# EasyEDA Pro project Imported QV-601-Contril.PrjPcb.epro

# Board QV-601-Contril
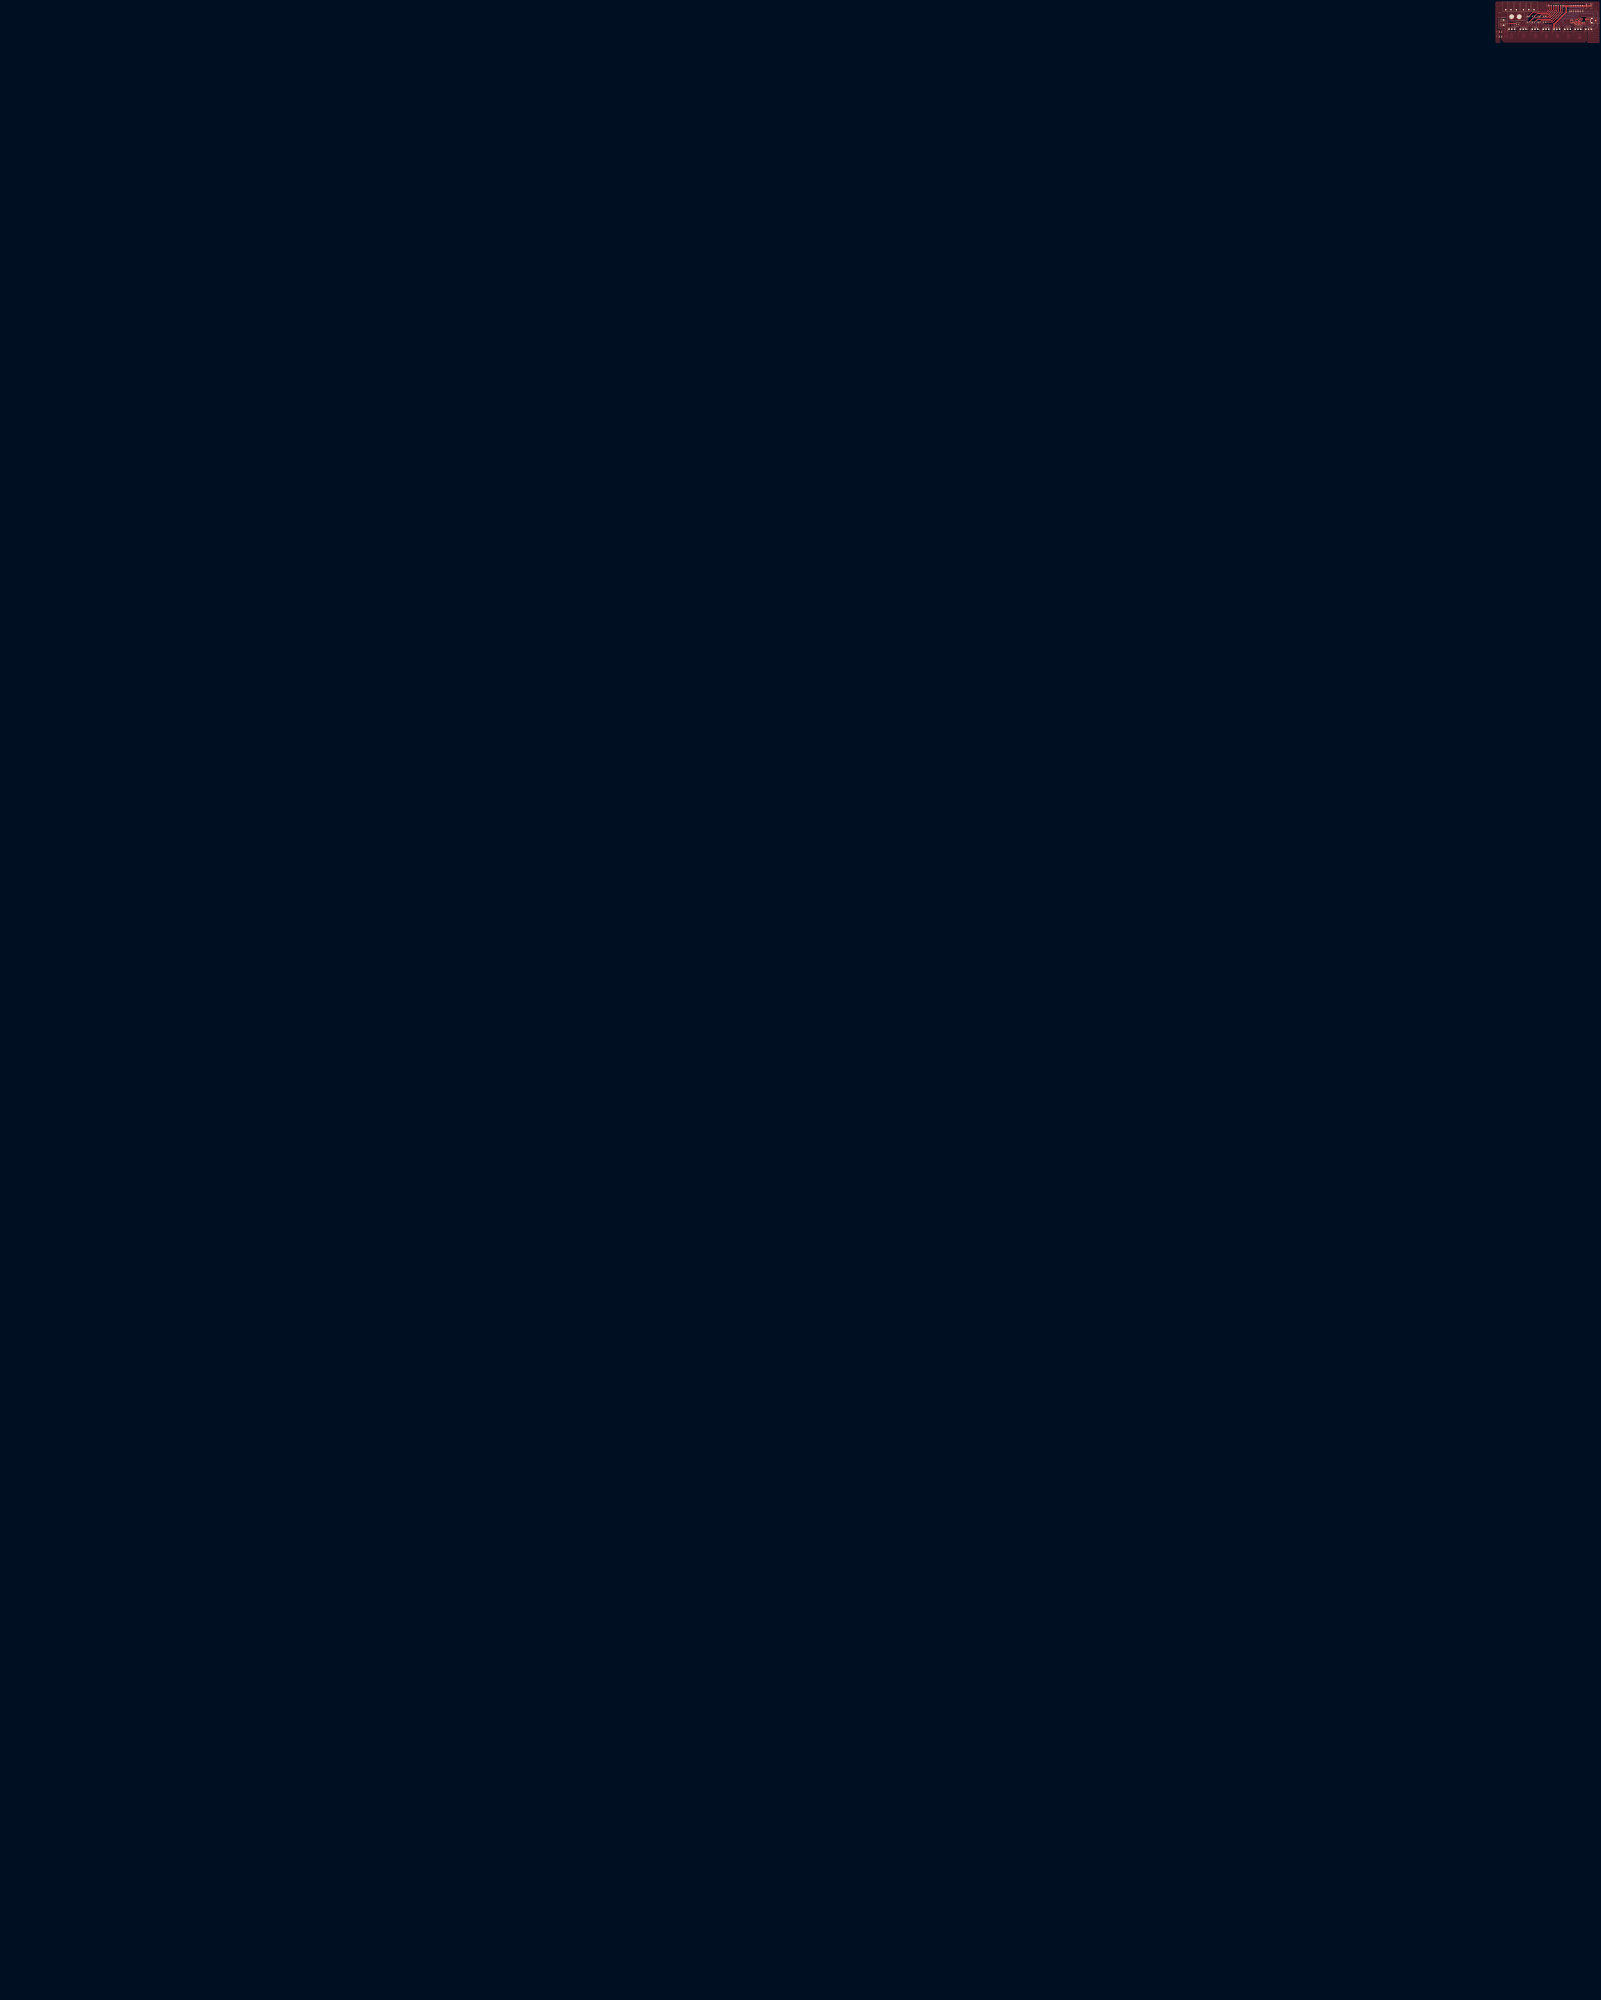
[diagram p0: board, top side]
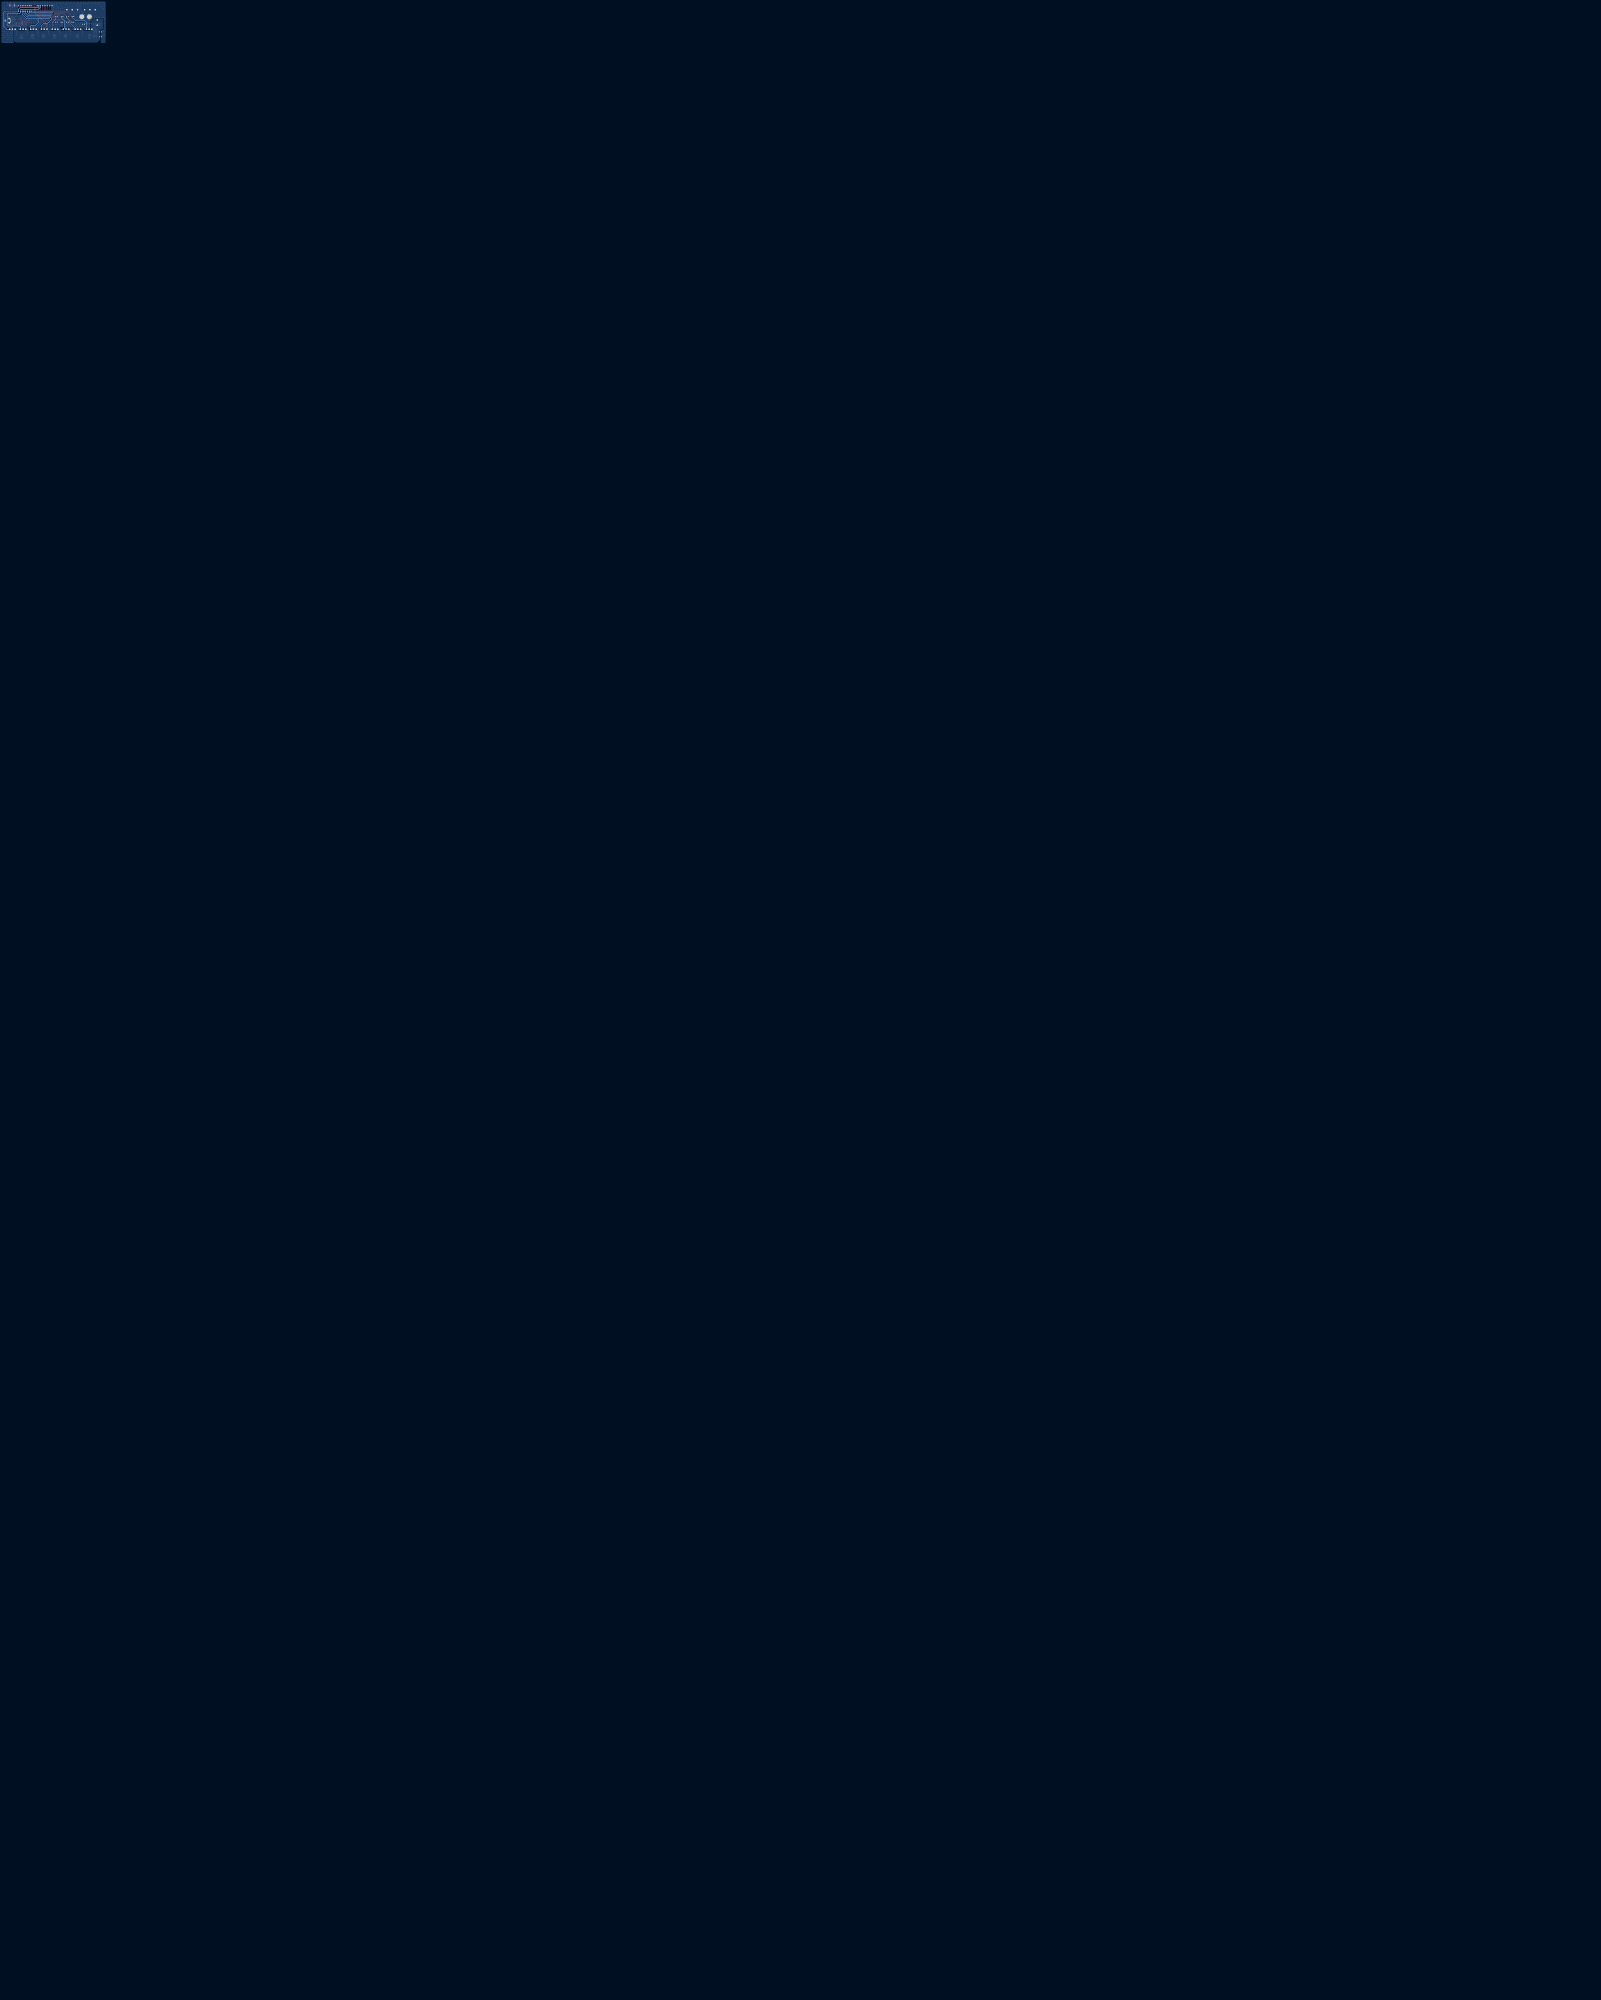
[diagram p1: board, bottom side, seen from below]

Outline 2297.48 x 2870.69 mm; copper layers: Top Layer, Bottom Layer. Coordinates in mm from the lower left corner of the outline.
Outline path: circle c2151.48,2866.69 r1.65 ; circle c2151.48,2814.69 r1.65 ; circle c2293.48,2866.69 r1.65 ; circle c2293.48,2814.69 r1.65 ; 2,663.2 2295.48,2810.69 ; 2,663.2 arc(1792.5,1021.52) 2147.48,2812.69 ; 2,663.2 2295.48,2810.69 ; 2295.48,2810.69 arc(2290.68,0) 150,665.2 2297.48,2868.69 ; 2297.48,2868.69 arc(2296.9,2870.1) 2295.48,2870.69 2149.48,2870.69 arc(2148.07,2870.1) 2147.48,2868.69 2147.48,2812.69 ; 2297.48,2868.69 2297.48,2812.69 ; 2147.48,2812.69 0,721.2

## Placement (name value [footprint] x y rotation side)
C52  CAP NP_C0603_100NF  [C0603]  2263.05 2842.96 90 top
C53  CAP NP_C0603_10UF/10V  [C0603]  2281.6 2845.88 90 top
C54  CAP NP_C0603_10UF/10V  [C0603]  2279.79 2845.88 90 top
C56  CAP NP_C1210_10UF/50V  [C1210]  2257.19 2841.73 90 top
C57  CAP NP_C0603_100NF  [C0603]  2259.75 2841.44 90 top
C58  CAP NP_C0603_100NF  [C0603]  2274.53 2839 180 top
C59  CAP NP_C0603_100NF  [C0603]  2274.53 2840.6 180 top
D1  SS54_SMA_SS34  [SMA]  2267.17 2844.61 180 top
J1  CON2_XT90PBM_XT90PB-M  [XT90PBM]  2170.99 2848.72 0 top
J2  CON2_DBT50G-7R62-2P1_DBT50G-7.6  [DBT50G-7R62-2P1]  2159.7 2844 270 top
J3  CON2_XH2R54-21_ZX-XH2.54-2PZZ  [XH2R54-21]  2156.27 2819.75 180 top
J4  CON2_XH2R54-21_ZX-XH2.54-2PZZ  [XH2R54-21]  2278.88 2864.27 90 top
J5  CON2_XH2R54-21_ZX-XH2.54-2PZZ  [XH2R54-21]  2285.18 2864.25 90 top
J6  CON2_XH2R54-21_ZX-XH2.54-2PZZ  [XH2R54-21]  2193.37 2849.26 0 top
J7  CON2_XH2R54-21_ZX-XH2.54-2PZZ  [XH2R54-21]  2201.22 2849.26 0 top
J8  CON2_XH2R54-21_ZX-XH2.54-2PZZ  [XH2R54-21]  2209.02 2849.26 0 top
J9  CON2_XH2R54-21_ZX-XH2.54-2PZZ  [XH2R54-21]  2216.64 2849.26 0 top
J10  CON2_XH2R54-21_ZX-XH2.54-2PZZ  [XH2R54-21]  2193.55 2840.85 0 top
J11  CON2_XH2R54-21_ZX-XH2.54-2PZZ  [XH2R54-21]  2180.86 2837.91 180 top
J12  CON2_XH2R54-21_ZX-XH2.54-2PZZ  [XH2R54-21]  2201.4 2840.85 0 top
J13  CON2_XH2R54-21_ZX-XH2.54-2PZZ  [XH2R54-21]  2209.2 2840.85 0 top
J14  CON2_XH2R54-21_ZX-XH2.54-2PZZ  [XH2R54-21]  2216.82 2840.85 0 top
J15  CON2_XH2R54-21_ZX-XH2.54-2PZZ  [XH2R54-21]  2156.27 2826.71 180 top
L4  JLSHC0630_3R3M_L0650_CYA0650-22  [L0650]  2272.15 2845.27 90 top
R35  R2_R0603_42.2K  [R0603]  2272.07 2837.07 0 top
R36  R2_R0603_8K  [R0603]  2268.97 2837.07 0 top
R37  R2_R0603_51K  [R0603]  2261.35 2839.91 90 top
R38  R2_R0603_10K  [R0603]  2272.2 2839.84 270 top
R39  R2_R0603_8K  [R0603]  2262.98 2838.39 90 top
R40  R2_R0603_160K  [R0603]  2265.62 2837.07 180 top
U1  CON3_DBT50G-7R62-3P1_DBT50G-7.6  [DBT50G-7R62-3P1]  2170.19 2859.81 180 top
U2  CON10_XH2R54-10P1_ZX-XH2.54-10P  [XH2R54-10P1]  2246.05 2864.35 180 top
U3  CON3_DBT50G-7R62-3P1_DBT50G-7.6  [DBT50G-7R62-3P1]  2195.64 2859.81 180 top
U4  DIP_8P_TA-08R1_TA-08R  [TA-08R1]  2272.68 2856.7 180 top
U5  CON3_VH3R96-3P1_VH3.96-3P ZZ  [VH3R96-3P1]  2266.33 2830.67 0 top
U6  CON3_VH3R96-3P1_VH3.96-3P ZZ  [VH3R96-3P1]  2171.28 2830.67 0 top
U7  CON3_VH3R96-3P1_VH3.96-3P ZZ  [VH3R96-3P1]  2187.62 2830.67 0 top
U8  CON3_VH3R96-3P1_VH3.96-3P ZZ  [VH3R96-3P1]  2204.63 2830.67 0 top
U9  CON3_VH3R96-3P1_VH3.96-3P ZZ  [VH3R96-3P1]  2220.31 2830.67 0 top
U10  CON3_VH3R96-3P1_VH3.96-3P ZZ  [VH3R96-3P1]  2235.88 2830.67 0 top
U11  CON3_VH3R96-3P1_VH3.96-3P ZZ  [VH3R96-3P1]  2251.37 2830.67 0 top
U12  CON3_VH3R96-3P1_VH3.96-3P ZZ  [VH3R96-3P1]  2281.57 2830.67 0 top
U40  TPS54360BDDAR_SOIC8E_TPS54360BD  [SOIC8E]  2267.53 2840.27 270 top
U41  USB2R0_CECHA_USB2R0_CECHA_USB2R  [USB2R0_CECHA]  2284.21 2840.92 180 top

## Footprints (pads in the part's own frame, mm; a bottom-side part is the same pattern mirrored in y, then rotated)
C0603
  rect 0.762x0.813 smd: 1(-0.762,0) 2(0.762,0)
C1210
  rect 1.6x2.7 smd: 1(-1.516,0) 2(1.516,0)
DBT50G-7R62-2P1
  round 2.3 hole 1.7: 1(0,0) 2(7.62,0)
DBT50G-7R62-3P1
  round 2.3 hole 1.7: 1(-7.62,1.1) 2(0,1.1) 3(7.62,1.1)
L0650
  rect 3x1.5 smd: 1(0,0) 2(0,-5.7)
R0603
  rect 0.762x0.813 smd: 1(-0.762,0) 2(0.762,0)
SMA
  rect 1.6x1.6 smd: 1(-1.95,0) 2(1.95,0)
SOIC8E
  oval 0.6x1.6 smd: 1(-1.905,-2.7) 2(-0.635,-2.7) 3(0.635,-2.7) 4(1.905,-2.7) 5(1.905,2.7) 6(0.635,2.7) 7(-0.635,2.7) 8(-1.905,2.7)
  rect 3.1x2.4 smd: 9(0,0)
TA-08R1
  round 1.57 hole 0.97: 1(0,-7.62) 2(2.54,-7.62) 3(5.08,-7.62) 4(7.62,-7.62) 5(10.16,-7.62) 6(12.7,-7.62) 7(15.24,-7.62) 8(17.78,-7.62) 9(17.78,0) 10(15.24,0) 11(12.7,0) 12(10.16,0) 13(7.62,0) 14(5.08,0) 15(2.54,0) 16(0,0)
USB2R0_CECHA
  round 1.2 hole 0.8: 1(0,-4.2) 2(0,-2.8) 3(0,-1.4) 4(0,0)
  oval 2.9x2.4 hole 1.9: 5(-2,0.98) 6(-2,-5.18)
  oval 2.7x4.4 hole 0.9: 7(-7.6,-2.1)
VH3R96-3P1
  round 2.4 hole 1.8: 1(-3.96,0) 2(0,0) 3(3.96,0)
XH2R54-10P1
  round 1.5 hole 0.9: 1(0,0) 2(2.5,0) 3(5,0) 4(7.5,0) 5(10,0) 6(12.5,0) 7(15,0) 8(17.5,0) 9(20,0) 10(22.5,0)
XH2R54-21
  round 1.5 hole 0.9: 1(0,0) 2(2.5,0)
XT90PBM
  round 8 hole 6: 1(0,0) 2(11,0)

## Nets
GND: C53.2 C54.2 C56.2 C57.2 C58.1 C59.1 D1.1 J1.2 J3.2 J4.2 J5.2 J6.1 J7.1 J8.1 J9.1 J10.1 J11.1 J12.1 J13.1 J14.1 J15.2 R36.1 R39.1 R40.1 U2.10 U3.1 U3.2 U3.3 U5.2 U6.2 U7.2 U8.2 U9.2 U10.2 U11.2 U12.2 U40.7 U40.9 U41.4 U41.5 U41.6 U41.7
VCC_5V: C53.1 C54.1 L4.2 R35.2 U41.1
1.2: J8.2 U2.7 U4.11 U8.3
1.4: J10.2 U2.5 U4.13 U10.3
1.5: J9.2 U2.6 U4.12 U9.3
2.4: J14.2 U2.2 U4.16 U12.3
5.2: J12.2 U2.4 U4.14 U11.3
5.8: J6.2 U2.9 U4.9 U6.3
433: J13.2 U2.3 U4.15 U5.3
900: J7.2 U2.8 U4.10 U7.3
V+: C56.1 C57.1 J2.1 J2.2 J3.1 J4.1 J5.1 J11.2 J15.1 R37.2 U2.1 U4.1 U4.2 U4.3 U4.4 U4.5 U4.6 U4.7 U4.8 U5.1 U6.1 U7.1 U8.1 U9.1 U10.1 U11.1 U12.1 U40.2
N41242: J1.1 U1.1 U1.2 U1.3
N62769: R37.1 R39.2 U40.3
N62809: R40.2 U40.4
N62825: C52.1 U40.1
N62837: C52.2 D1.2 L4.1 U40.8
N62937: C58.2 R38.2 U40.6
N62993: C59.2 R38.1
N63043: R35.1 R36.2 U40.5

Pads without a net: U41 2 3

## Via types
v1: diameter 0.762, hole 0.508, Top Layer to Bottom Layer, 661 vias
v2: diameter 0.54, hole 0.254, Top Layer to Bottom Layer, 7 vias

## Routing (per net, layer and track width the routed paths; a pad name or vN(x,y) marks a point on that pad's centre or on a via; arc(x,y) is an arc through that point)
GND:
  vias: v1(2148.4,2844.31) v1(2148.4,2841.92) v1(2148.42,2836.87) v1(2148.37,2834.4) v1(2148.42,2827.04) v1(2148.4,2824.27) v1(2148.5,2866.76) v1(2148.5,2852.77) v1(2148.5,2849.64) v1(2148.45,2846.95) v1(2148.5,2838.97) v1(2148.53,2829.86) v1(2148.55,2859.29) v1(2148.58,2855.94) v1(2148.55,2831.81) v1(2148.75,2863.05) v1(2148.98,2869.12) v1(2149.08,2822.03) v1(2149.72,2845.58) v1(2150.61,2827.42) v1(2150.68,2860.72) v1(2150.94,2869.58) v1(2151.09,2847.79) v1(2151.37,2821.55) v1(2151.45,2829.02) v1(2153.17,2863.21) v1(2153.45,2869.58) v1(2153.48,2847.74) v1(2153.63,2827.06) v1(2153.88,2821.52) v1(2155.79,2869.68) v1(2155.89,2865.92) v1(2156.12,2847.76) v1(2158.38,2869.63) v1(2158.61,2867.98) v1(2158.53,2847.69) v1(2161.07,2847.66) v1(2161.63,2869.76) v1(2162.57,2867.73) v1(2163.59,2847.84) v1(2164.91,2869.73) v1(2165.85,2845.91) v1(2166.05,2867.75) v1(2167.78,2843.98) v1(2168.64,2869.71) v1(2170.27,2867.7) v1(2170.57,2840.95) v1(2170.65,2842.99) v1(2170.65,2837.12) v1(2170.72,2834.53) v1(2170.75,2832.57) v1(2172.27,2843.01) v1(2172.5,2835.24) v1(2172.58,2869.76) v1(2172.78,2831.61) v1(2172.81,2829.96) v1(2173.47,2840.88) v1(2173.52,2837.07) v1(2173.49,2833.06) v1(2173.54,2867.73) v1(2174.48,2842.94) v1(2176.21,2869.86) v1(2176.52,2844.71) v1(2176.57,2867.7) v1(2176.97,2833.31) v1(2177.05,2835.06) v1(2177.56,2847.03) v1(2177.66,2850.43) v1(2177.76,2831.94) v1(2177.76,2830.06) v1(2178.07,2840.95) v1(2178.19,2851.98) v1(2178.24,2835.8) v1(2178.75,2844.97) v1(2178.78,2833.67) v1(2179.36,2867.52) v1(2180,2869.83) v1(2179.97,2854.04) v1(2180.12,2841.08) v1(2180.28,2844.51) v1(2180.45,2836.46) v1(2180.73,2834) v1(2181.11,2855.2) v1(2181.9,2866.99) v1(2182.1,2840.65) v1(2182.59,2856.65) v1(2182.94,2844.41) v1(2182.97,2833.92) v1(2183.07,2836.08) v1(2183.3,2863.05) v1(2183.37,2859.27) v1(2183.5,2838.75) v1(2183.98,2869.83) v1(2184.16,2845.37) v1(2184.21,2840.68) v1(2184.44,2867.57) v1(2184.8,2854.11) v1(2185.2,2834.02) v1(2185.25,2837.73) v1(2185.56,2857.24) v1(2185.56,2836.08) v1(2185.91,2860.11) v1(2185.96,2865.08) v1(2186.45,2839.43) v1(2186.55,2832.12) v1(2187.18,2854.65) v1(2187.26,2862.57) v1(2187.51,2844.64) v1(2187.54,2834.27) v1(2187.64,2840.83) v1(2187.77,2849.18) v1(2187.87,2836.87) v1(2188.43,2869.81) v1(2188.45,2867.45) v1(2188.96,2831.71) v1(2189.04,2860.64) v1(2189.06,2829.86) v1(2189.47,2854.39) v1(2189.5,2835.9) v1(2189.44,2833.69) v1(2189.57,2845.27) v1(2190.18,2864.25) v1(2190.26,2852.03) v1(2190.89,2840.62) v1(2190.97,2838.41) v1(2191.04,2836.99) v1(2191.25,2846.39) v1(2191.4,2835.01) v1(2191.65,2858.73) v1(2191.86,2849.69) v1(2192.26,2855.08) v1(2192.52,2848.17) v1(2192.85,2867.22) v1(2192.92,2836.36) v1(2193.2,2869.81) v1(2193.41,2851.24) v1(2193.92,2856.47) v1(2193.89,2830.97) v1(2193.97,2829.91) v1(2194.6,2860.89) v1(2194.6,2852.77) v1(2194.6,2838.06) v1(2194.7,2863.84) v1(2194.85,2832.24) v1(2194.96,2830.54) v1(2196.12,2834.05) v1(2196.25,2854.59) v1(2196.63,2856.93) v1(2197.17,2869.86) v1(2197.45,2861.17) v1(2197.75,2867.19) v1(2197.8,2835.57) v1(2198.18,2834.02) v1(2199.07,2863.76) v1(2199.17,2837.78) v1(2199.93,2856.83) v1(2200.44,2839.28) v1(2200.6,2869.89) v1(2200.57,2835.75) v1(2200.87,2833.97) v1(2200.98,2858.79) v1(2201.51,2837.27) v1(2201.64,2839.76) v1(2202.12,2866.46) v1(2202.27,2861.88) v1(2202.7,2839.23) v1(2202.93,2834.45) v1(2203.41,2831.99) v1(2203.36,2829.8) v1(2203.62,2836.33) v1(2203.64,2856.7) v1(2203.74,2869.68) v1(2204.76,2833.08) v1(2205.14,2834.94) v1(2205.24,2865.95) v1(2205.37,2837.25) v1(2205.47,2832.14) v1(2205.65,2829.73) v1(2206.34,2862.01) v1(2206.46,2858.51) v1(2206.54,2856.7) v1(2207.78,2869.73) v1(2209.21,2839.48) v1(2209.23,2867.29) v1(2209.26,2860.41) v1(2209.26,2837.14) v1(2209.26,2834.1) v1(2209.49,2862.54) v1(2209.79,2856.88) v1(2209.87,2835.77) v1(2210.48,2839.33) v1(2210.91,2829.68) v1(2210.98,2830.72) v1(2211.16,2869.76) v1(2211.34,2837.14) v1(2211.77,2834.3) v1(2212.13,2864.93) v1(2212.43,2856.8) v1(2212.76,2860.03) v1(2212.94,2835.85) v1(2213.98,2867.57) v1(2214.13,2833.61) v1(2214.67,2869.73) v1(2214.72,2837.12) v1(2214.77,2857.85) v1(2215.1,2862.44) v1(2215.73,2856.73) v1(2216.01,2860.36) v1(2216.34,2835.8) v1(2216.44,2833.77) v1(2217.31,2862.49) v1(2217.69,2867.47) v1(2217.79,2837.27) v1(2217.99,2869.71) v1(2218.3,2864.68) v1(2218.65,2856.7) v1(2218.73,2833.41) v1(2218.88,2859.8) v1(2219.11,2832.06) v1(2219.09,2829.68) v1(2220.13,2837.27) v1(2220.05,2835.21) v1(2220.31,2858.1) v1(2220.99,2864.07) v1(2221.37,2869.94) v1(2221.5,2832.09) v1(2221.6,2866.74) v1(2221.58,2829.75) v1(2222.31,2862.39) v1(2222.24,2859.67) v1(2222.52,2836.28) v1(2222.54,2837.35) v1(2222.54,2833.74) v1(2223.91,2866.15) v1(2224.52,2862.11) v1(2224.65,2870.01) v1(2226.07,2867.5) v1(2226.12,2832.57) v1(2226.25,2837.27) v1(2226.53,2829.68) v1(2226.55,2831.33) v1(2226.63,2835.62) v1(2227.6,2834.2) v1(2228.18,2869.96) v1(2228.46,2837.2) v1(2228.97,2835.39) v1(2229.17,2833.64) v1(2231,2867.6) v1(2231.33,2869.94) v1(2234.1,2833.56) v1(2234.35,2836.97) v1(2234.71,2867.78) v1(2234.73,2829.68) v1(2234.83,2869.94) v1(2234.83,2831.91) v1(2234.99,2835.49) v1(2235.62,2837.5) v1(2235.93,2833.64) v1(2236.49,2832.12) v1(2236.94,2835.57) v1(2237.35,2830.26) v1(2237.65,2832.06) v1(2237.76,2833.87) v1(2238.01,2840.52) v1(2238.19,2869.99) v1(2239.3,2867.68) v1(2239.48,2838.97) v1(2239.58,2842.05) v1(2240.88,2843.27) v1(2240.91,2840.5) v1(2240.98,2837.7) v1(2241.67,2834.78) v1(2241.77,2869.89) v1(2241.74,2832.14) v1(2241.77,2829.55) v1(2242,2844.33) v1(2242.18,2841.92) v1(2242.71,2839.35) v1(2242.71,2833.33) v1(2244.21,2837.68) v1(2244.13,2835.32) v1(2245.17,2869.94) v1(2245.43,2844.49) v1(2245.53,2867.65) v1(2245.45,2843.11) v1(2245.88,2835.98) v1(2246.09,2841.23) v1(2246.16,2833.56) v1(2247.46,2844.49) v1(2247.66,2839.68) v1(2247.86,2834.45) v1(2248.27,2869.96) v1(2248.35,2842.38) v1(2249.19,2838.19) v1(2249.77,2844.49) v1(2249.74,2833.26) v1(2250.28,2867.8) v1(2250.43,2831.94) v1(2250.79,2840.5) v1(2250.73,2834.5) v1(2251.52,2838.21) v1(2251.6,2869.99) v1(2251.67,2842.5) v1(2251.83,2833.28) v1(2251.85,2844.49) v1(2252.82,2829.91) v1(2252.89,2831.71) v1(2253,2834.5) v1(2253.66,2833.26) v1(2254.42,2840.68) v1(2254.39,2838.24) v1(2254.7,2844.51) v1(2254.8,2869.91) v1(2255,2842.78) v1(2256.37,2867.85) v1(2256.5,2844.49) v1(2257.01,2835.19) v1(2256.98,2834.05) v1(2258.33,2844.54) v1(2258.89,2867.22) v1(2258.96,2869.91) v1(2258.99,2842.94) v1(2260.36,2843.06) v1(2261.33,2833.74) v1(2261.38,2837.78) v1(2261.35,2835.8) v1(2261.5,2844.49) v1(2261.78,2842.35) v1(2262.83,2833.84) v1(2262.93,2869.83) v1(2262.85,2867.22) v1(2262.95,2836.79) v1(2263.51,2835.37) v1(2264.2,2846.34) v1(2264.76,2833.69) v1(2265.31,2835.67) v1(2265.52,2832.34) v1(2265.7,2847.79) v1(2266.38,2842.38) v1(2266.56,2867.27) v1(2266.56,2838.08) v1(2266.72,2841.41) v1(2266.72,2839.18) v1(2266.74,2840.35) v1(2267.27,2849.31) v1(2267.27,2837.12) v1(2267.52,2835.62) v1(2267.8,2869.81) v1(2267.83,2845.68) v1(2267.78,2831.63) v1(2267.85,2833.64) v1(2268.21,2847.46) v1(2268.16,2838.11) v1(2268.27,2840.24) v1(2268.29,2839.15) v1(2268.34,2841.39) v1(2269.12,2851.11) v1(2269.05,2835.7) v1(2270.22,2847.79) v1(2270.24,2867.27) v1(2270.32,2845.73) v1(2270.29,2844.18) v1(2271.39,2851.14) v1(2271.44,2849.26) v1(2271.97,2869.89) v1(2272.63,2832.24) v1(2272.66,2830.03) v1(2273.95,2851.39) v1(2274.08,2849.21) v1(2274.48,2854.85) v1(2274.56,2858.61) v1(2274.66,2861.94) v1(2274.99,2867.29) v1(2275.37,2839.81) v1(2275.45,2838.16) v1(2276.08,2851.39) v1(2276.08,2840.57) v1(2276.49,2869.94) v1(2276.47,2839.02) v1(2276.8,2854.87) v1(2276.87,2849.26) v1(2277.51,2837.02) v1(2277.58,2858.66) v1(2278.24,2861.96) v1(2278.65,2838.14) v1(2278.78,2851.45) v1(2278.8,2840.04) v1(2279.31,2849.16) v1(2279.41,2854.85) v1(2279.39,2843.77) v1(2279.34,2841.67) v1(2279.46,2847.56) v1(2279.89,2837.07) v1(2280.43,2869.91) v1(2280.61,2811.64) v1(2280.68,2846.7) v1(2280.66,2821.73) v1(2280.71,2819.09) v1(2280.68,2813.93) v1(2280.73,2867.17) v1(2280.76,2858.63) v1(2280.81,2828.81) v1(2280.81,2816.47) v1(2280.94,2826.65) v1(2281.11,2843.85) v1(2281.14,2840.27) v1(2281.27,2842.15) v1(2281.37,2824.19) v1(2281.47,2851.5) v1(2281.67,2849.36) v1(2281.75,2847.76) v1(2281.9,2854.8) v1(2281.88,2837.07) v1(2281.95,2861.83) v1(2282.03,2838.9) v1(2282.26,2832.45) v1(2282.59,2846.72) v1(2282.71,2843.83) v1(2282.69,2841.72) v1(2282.82,2829.14) v1(2282.89,2821.47) v1(2283.07,2811.67) v1(2283.42,2848.85) v1(2283.45,2867.12) v1(2283.78,2858.58) v1(2283.93,2837.07) v1(2283.96,2826.45) v1(2283.93,2815.33) v1(2284.06,2839.81) v1(2284.14,2851.5) v1(2284.14,2818.6) v1(2284.24,2846.97) v1(2284.47,2824.24) v1(2284.72,2860.28) v1(2284.69,2854.82) v1(2284.64,2833.49) v1(2284.8,2869.76) v1(2285.38,2848.63) v1(2285.76,2844.43) v1(2285.76,2842.17) v1(2285.79,2821.52) v1(2285.99,2811.57) v1(2286.24,2837.04) v1(2286.8,2866.51) v1(2286.78,2862.34) v1(2287.34,2851.34) v1(2287.41,2849.26) v1(2287.41,2847.46) v1(2287.51,2844.31) v1(2287.46,2838.54) v1(2287.56,2854.87) v1(2287.56,2841.26) v1(2287.56,2818.68) v1(2287.87,2827.09) v1(2288,2858.66) v1(2288.05,2824.22) v1(2288.28,2815.33) v1(2288.45,2833.69) v1(2288.83,2869.73) v1(2288.86,2864.4) v1(2288.86,2811.62) v1(2289.04,2821.5) v1(2289.19,2867.83) v1(2290.1,2860.51) v1(2290.1,2853.1) v1(2290.38,2835.8) v1(2290.56,2849.08) v1(2290.71,2846.54) v1(2290.66,2824.34) v1(2290.82,2838.16) v1(2290.84,2840.45) v1(2290.94,2818.6) v1(2291.35,2811.47) v1(2291.6,2854.72) v1(2291.76,2851.19) v1(2292.31,2821.57) v1(2292.39,2830.19) v1(2292.49,2846.09) v1(2292.57,2827.7) v1(2292.67,2869.73) v1(2292.8,2838.14) v1(2292.75,2836.36) v1(2292.92,2863.48) v1(2293.1,2858.71) v1(2293.2,2861.2) v1(2293.28,2852.77) v1(2293.38,2847.91) v1(2294.7,2818.88) v1(2294.78,2832.88) v1(2295.31,2811.57) v1(2295.67,2821.6) v1(2296.28,2869.48) v1(2296.48,2861.22) v1(2296.61,2865.44) v1(2296.58,2858.02) v1(2296.58,2853.86) v1(2296.58,2838.44) v1(2296.58,2831.61) v1(2296.53,2827.62) v1(2296.53,2823.81) v1(2296.63,2850.23) v1(2296.68,2842.43) v1(2296.68,2835.01) v1(2296.76,2846.39) v1(2296.79,2813.65) v1(2296.84,2817.31) v2(2272.5,2833.84) v2(2273.93,2833.92) v2(2274.99,2833.92) v2(2276.29,2833.94) v2(2277.84,2833.92) v2(2279.51,2833.94) v2(2280.81,2833.87)
VCC_5V: length 18.7
  Top Layer w0.6: R35.2 2272.93,2837.17 2276.34,2837.17 2277.85,2838.68 L4.2
  Top Layer w0.8: U41.1 C53.1 C54.1 2278,2845.12 L4.2
1.2: length 88.5
  Top Layer w1: 2224.78,2852.41 v1(2224.78,2852.46) ; 2224.78,2852.41 2231.05,2858.68 U2.7 ; 2224.78,2852.41 2223.63,2851.27 2213.52,2851.27 J8.2
  Bottom Layer w1: U4.11 2259.98,2854.67 2257.77,2852.46 v1(2224.78,2852.46) ; U8.3 2206.92,2832.34 2206.92,2842.76 2211.52,2847.36 J8.2
1.4: length 125.5
  Top Layer w1: 2227.27,2848.27 2236.05,2857.05 U2.5 ; 2227.27,2848.27 v1(2227.27,2848.32) ; 2227.27,2848.27 2226.02,2847.03 2202.22,2847.03 J10.2
  Bottom Layer w1: U10.3 2239.89,2830.72 2239.89,2835.87 2236.66,2839.1 2230.85,2839.1 2225.19,2844.76 2225.19,2846.17 2227.27,2848.24 v1(2227.27,2848.32) 2260.36,2848.32 2265.06,2853.02 2265.06,2856.7
1.5: length 86.2
  Top Layer w1: 2226,2850.33 v1(2226,2850.35) ; 2226,2850.33 2233.55,2857.88 U2.6 ; 2226,2850.33 2224.93,2849.26 J9.2
  Bottom Layer w1: v1(2226,2850.35) 2258.96,2850.35 2262.52,2853.91 U4.12 ; U9.3 2224.47,2830.87 2224.47,2840.22 2219.14,2845.55 J9.2
2.4: length 128.3
  Top Layer w1: J14.2 2230.16,2840.85 2243.55,2854.24 U2.2
  Bottom Layer w1: U12.3 2285.66,2830.54 2289.75,2830.54 2294.88,2835.67 2294.88,2854.77 2292.95,2856.7 U4.16 2272.71,2856.73 2272.71,2859.55 2270.55,2861.71 2244.92,2861.71 2243.55,2863.08 U2.2
5.2: length 119.2
  Top Layer w1: U2.4 2238.55,2856.15 2228.48,2846.09 ; 2228.48,2846.09 v1(2228.48,2846.14) ; 2228.48,2846.09 2227.27,2844.87 2207.91,2844.87 J12.2
  Bottom Layer w1: U11.3 2255.36,2830.7 2255.36,2835.19 2254.34,2836.21 2248.4,2836.21 2243.8,2840.8 2243.8,2846.14 ; v1(2228.48,2846.14) 2243.8,2846.14 ; 2243.8,2846.14 2261.61,2846.14 2267.6,2852.13 2267.6,2856.7
5.8: length 106.2
  Top Layer w1: U2.9 2226.05,2859.88 2222.85,2856.68 ; 2222.85,2856.68 2221.47,2855.31 2201.92,2855.31 J6.2 ; 2222.85,2856.68 v1(2222.85,2856.7)
  Bottom Layer w1: J6.2 2195.87,2847.84 2190.94,2842.91 2177.38,2842.91 2175.24,2840.77 U6.3 ; v1(2222.85,2856.7) U4.9
433: length 139.9
  Top Layer w1: U2.3 2241.05,2855.2 2228.71,2842.86 2213.7,2842.86 J13.2
  Bottom Layer w1: U2.3 2241.05,2862.5 2244.31,2859.24 2269.14,2859.24 2270.14,2858.24 U4.15 2270.14,2854.24 2271.36,2853.02 2288.25,2853.02 2289.06,2852.21 2289.06,2837.08 2287.35,2835.37 2271.39,2835.37 2269.94,2833.92 2269.94,2831.02 U5.3
900: length 93.3
  Top Layer w1: 2223.58,2854.32 2228.55,2859.28 U2.8 ; 2223.58,2854.32 v1(2223.58,2854.37) ; 2223.58,2854.32 2222.57,2853.3 2207.76,2853.3 J7.2
  Bottom Layer w1: U7.3 2191.58,2832.47 2198.92,2839.81 2198.92,2842.2 2203.72,2847 J7.2 ; U4.10 2257.44,2855.41 2256.4,2854.37 v1(2223.58,2854.37)
V+: length 97.5
  Top Layer w0.8: C57.1 R37.2 2261.58,2840.9 U40.2
  Top Layer w1: J11.2 2177.27,2839 2167.27,2839
  Top Layer w2: 2251.06,2864.32 2246.07,2864.32 U2.1 ; 2251.06,2864.32 2249.57,2862.83 2249.57,2855.31 2232.04,2837.78 2232.04,2830.79 U10.1 ; 2251.06,2864.32 U4.1 2275.07,2864.32 2275.12,2864.27 J4.1 2278.9,2864.25 J5.1
  vias: v1(2154.37,2835.49) v1(2154.49,2839.25) v1(2154.44,2837.48) v1(2156.15,2839.25) v1(2156.15,2837.45) v1(2156.25,2835.67) v1(2157.97,2839.25) v1(2157.97,2837.3) v1(2157.97,2835.62) v1(2160.01,2837.2) v1(2160.08,2835.7) v1(2160.18,2839.23) v1(2160.97,2831.02) v1(2161,2827.26) v1(2160.97,2825.59) v1(2161.05,2828.99) v1(2161.18,2823.78) v1(2161.2,2820.02) v1(2161.18,2818.35) v1(2161.25,2821.75) v1(2162.14,2837.32) v1(2162.19,2835.57) v1(2162.42,2839.28) v1(2162.6,2833.56) v1(2162.65,2828.94) v1(2162.77,2830.9) v1(2162.75,2827.32) v1(2162.85,2821.7) v1(2162.95,2825.54) v1(2162.98,2823.65) v1(2162.96,2820.07) v1(2163.16,2818.3) v1(2164.43,2839.2) v1(2164.37,2833.33) v1(2164.45,2835.47) v1(2164.45,2830.85) v1(2164.45,2828.99) v1(2164.48,2827.24) v1(2164.55,2837.14) v1(2164.65,2825.66) v1(2164.66,2823.6) v1(2164.66,2821.75) v1(2164.68,2820) v1(2164.86,2818.42) v1(2168.7,2823.25) v1(2168.72,2819.49) v1(2168.7,2817.81) v1(2168.77,2821.22) v1(2170.37,2821.17) v1(2170.5,2823.12) v1(2170.47,2819.54) v1(2170.68,2817.76) v1(2172.18,2823.07) v1(2172.18,2821.22) v1(2172.2,2819.46) v1(2172.38,2817.89) v1(2180.91,2827.16) v1(2180.86,2825.18) v1(2180.83,2822.95) v1(2186.6,2823.73) v1(2186.63,2819.97) v1(2186.6,2818.3) v1(2186.68,2821.7) v1(2188.28,2821.65) v1(2188.41,2823.6) v1(2188.38,2820.02) v1(2188.59,2818.24) v1(2190.08,2823.55) v1(2190.08,2821.7) v1(2190.11,2819.95) v1(2190.29,2818.37) v1(2198.28,2827.14) v1(2198.28,2825.08) v1(2198.28,2823.1) v1(2203.72,2823.6) v1(2203.72,2818.17) v1(2203.8,2821.57) v1(2203.75,2819.84) v1(2205.4,2821.52) v1(2205.53,2823.48) v1(2205.5,2819.9) v1(2205.7,2818.12) v1(2207.2,2823.43) v1(2207.2,2821.57) v1(2207.23,2819.82) v1(2207.41,2818.24) v1(2213.47,2825.94) v1(2213.57,2823.33) v1(2213.75,2827.87) v1(2219.14,2823.48) v1(2219.22,2821.44) v1(2219.17,2819.72) v1(2219.14,2818.04) v1(2220.82,2821.39) v1(2220.92,2819.77) v1(2220.94,2823.35) v1(2221.12,2817.99) v1(2222.62,2823.3) v1(2222.62,2821.44) v1(2222.65,2819.69) v1(2222.82,2818.12) v1(2229.25,2825.44) v1(2229.35,2827.42) v1(2229.58,2823.61) v1(2234.89,2823.65) v1(2234.91,2819.9) v1(2234.89,2818.22) v1(2234.97,2821.62) v1(2236.57,2821.57) v1(2236.69,2823.53) v1(2236.67,2819.95) v1(2236.87,2818.17) v1(2238.37,2823.48) v1(2238.37,2821.62) v1(2238.39,2819.87) v1(2238.57,2818.3) v1(2244.92,2825.61) v1(2244.87,2823.63) v1(2244.97,2828.1) v1(2251.07,2823.35) v1(2251.09,2819.59) v1(2251.07,2817.91) v1(2251.15,2821.32) v1(2252.75,2821.27) v1(2252.87,2823.22) v1(2252.85,2819.64) v1(2253.05,2817.86) v1(2254.55,2823.17) v1(2254.55,2821.32) v1(2254.57,2819.57) v1(2254.75,2817.99) v1(2259.57,2823.38) v1(2259.65,2828.15) v1(2259.65,2825.84) v1(2266.56,2822.69) v1(2266.59,2818.93) v1(2266.56,2817.25) v1(2266.64,2820.66) v1(2268.24,2820.61) v1(2268.37,2822.56) v1(2268.34,2818.98) v1(2268.54,2817.2) v1(2270.04,2822.51) v1(2270.04,2820.66) v1(2270.07,2818.9) v1(2270.25,2817.33) v1(2275.27,2828.05) v1(2275.25,2825.94) v1(2275.42,2823.51)
N62769: length 3.7
  Top Layer w0.8: R37.1 R39.2 2263.46,2839.63 U40.3
N62809: length 1.3
  Top Layer w0.8: U40.4 2264.83,2837.09 R40.2
N62825: length 1.8
  Top Layer w0.8: C52.1 2263.08,2842.17 U40.1
N62837: length 8.8
  Top Layer w0.6: U40.8 2269.71,2842.17 2269.05,2842.83 2267.3,2842.83 2265.52,2844.61 D1.2
  Top Layer w0.8: C52.2 2263.05,2844.08 2263.62,2844.64 2265.19,2844.64 D1.2
N62937: length 3.8
  Top Layer w0.6: U40.6 2271.21,2839.63 2271.74,2839.1 2272.17,2839.1 R38.2 2273.7,2839.08 C58.2
N62993: length 1.6
  Top Layer w0.6: R38.1 C59.2
N63043: length 3.1
  Top Layer w0.6: R35.1 R36.2 2270.23,2837.57 U40.5

## Copper pours and planes (outline as drawn; the poured copper is in the pictures)
GND on Top Layer: 2274.86,2837.67 2274.86,2841.01 2277.34,2841.01 2277.34,2838.89 2276.13,2837.67
GND on Top Layer: 2297.28,2812.68 2297.28,2812.53 2297.26,2812.37 2297.22,2812.22 2297.18,2812.07 2297.12,2811.92 2297.04,2811.78 2296.96,2811.65 2296.86,2811.53 2296.76,2811.41 2296.64,2811.3 2296.52,2811.21 2296.38,2811.12 2296.24,2811.05 2296.1,2810.99 2295.95,2810.94 2295.8,2810.91 2295.64,2810.89 2295.48,2810.88 2280.07,2810.88 2280.07,2833.76 2274.51,2833.76 2273.29,2832.54 2273.29,2829.85 2272.78,2829.34 2272.15,2829.34 2271.84,2829.65 2271.84,2831.99 2271.18,2832.65 2268.79,2832.65 2268.44,2832.29 2268.44,2829.98 2267.75,2829.29 2264.86,2829.29 2264.86,2832.54 2264.15,2833.26 2260.92,2833.26 2260.92,2838.11 2261.1,2838.28 2263.59,2838.28 2263.64,2838.23 2263.64,2836.81 2264.15,2836.3 2265.95,2836.3 2265.95,2843.22 2266.12,2843.29 2267.09,2842.33 2268.84,2842.33 2269.1,2842.07 2269.1,2841.84 2269.68,2841.26 2271.49,2841.26 2271.49,2840.47 2269.33,2840.47 2268.95,2840.09 2268.95,2836.25 2268.97,2836.23 2274.51,2836.23 2274.86,2836.58 2274.86,2836.66 2276.55,2836.66 2278.35,2838.47 2278.35,2841.34 2278.9,2841.89 2278.9,2844.26 2278.92,2844.28 2282.99,2844.28 2283.3,2843.97 2283.3,2841.74 2283.58,2841.46 2284.64,2841.46 2285.1,2841.92 2285.1,2845.65 2284.58,2846.17 2278.9,2846.17 2278.9,2848.44 2278.7,2848.65 2271.21,2848.65 2270.78,2848.22 2270.78,2843.85 2270.47,2843.54 2268.13,2843.54 2268.01,2843.67 2268.01,2844.86 2267.07,2845.8 2263.36,2845.8 2262.22,2844.66 2262.22,2841.99 2262.06,2841.84 2255.48,2841.84 2255.1,2841.46 2255.1,2837.83 2257.5,2835.44 2257.5,2833.26 2254.62,2833.26 2253.45,2832.09 2253.45,2829.6 2253.05,2829.19 2249.69,2829.19 2249.64,2829.24 2249.64,2832.37 2248.88,2833.13 2243.17,2833.13 2242.2,2832.16 2242.2,2829.27 2242.05,2829.12 2241.57,2829.12 2241.36,2829.32 2241.36,2831.73 2240.7,2832.39 2238.9,2832.39 2238.03,2831.53 2238.03,2830.13 2237.1,2829.19 2234.58,2829.19 2234.28,2829.5 2234.28,2832.62 2233.87,2833.03 2233.84,2833.03 2233.84,2836.99 2253.55,2856.7 2253.55,2862.36 2263.46,2862.36 2263.61,2862.52 2286.17,2862.52 2287.08,2863.43 2287.08,2864.73 2285.56,2866.25 2226.15,2866.25 2225.06,2865.16 2225.06,2860.43 2220.94,2856.32 2199.63,2856.32 2194.52,2851.21 2194.52,2840.01 2194.96,2839.58 2196.61,2839.58 2198.89,2841.87 2202.4,2841.87 2202.4,2840.04 2203.01,2839.43 2204.61,2839.43 2207.05,2841.87 2210.2,2841.87 2210.2,2840.24 2211.01,2839.43 2212.23,2839.43 2214.67,2841.87 2217.51,2841.87 2217.87,2841.51 2217.87,2838.94 2219.06,2837.75 2228.79,2837.75 2230.19,2836.35 2230.19,2833.03 2227.7,2833.03 2227.01,2832.34 2227.01,2829.27 2226.88,2829.14 2225.84,2829.14 2225.84,2832.01 2225.59,2832.26 2222.52,2832.26 2222.06,2831.81 2222.06,2829.57 2221.7,2829.22 2218.93,2829.22 2218.71,2829.45 2218.71,2832.54 2218.15,2833.1 2212.3,2833.1 2211.42,2832.21 2211.42,2829.27 2211.34,2829.19 2210.37,2829.19 2210.22,2829.34 2210.22,2832.04 2209.92,2832.34 2207.17,2832.34 2206.74,2831.91 2206.74,2830 2206.06,2829.32 2203.21,2829.32 2202.98,2829.55 2202.98,2832.54 2202.25,2833.28 2196.51,2833.28 2195.52,2832.29 2195.52,2829.78 2195.24,2829.5 2193.28,2829.5 2193.28,2832.16 2192.75,2832.7 2190.46,2832.7 2189.77,2832.01 2189.77,2829.42 2189.67,2829.32 2186.09,2829.32 2185.99,2829.42 2185.99,2832.47 2185.2,2833.26 2179.74,2833.26 2178.62,2832.14 2178.62,2829.52 2178.52,2829.42 2177.18,2829.42 2177.05,2829.55 2177.05,2832.04 2176.64,2832.44 2173.75,2832.44 2173.39,2832.09 2173.39,2829.62 2173.21,2829.45 2170.27,2829.45 2170.06,2829.65 2170.06,2837.67 2176.08,2837.67 2177.32,2836.43 2179.44,2836.43 2179.64,2836.63 2179.64,2839.2 2178.55,2840.29 2170.57,2840.29 2164.12,2846.74 2150.76,2846.74 2150.51,2846.49 2150.51,2829.98 2150.81,2829.67 2154.55,2829.67 2154.55,2810.88 2149.48,2810.88 2149.33,2810.89 2149.17,2810.91 2149.02,2810.94 2148.87,2810.99 2148.72,2811.05 2148.58,2811.12 2148.45,2811.21 2148.33,2811.3 2148.21,2811.41 2148.11,2811.53 2148.01,2811.65 2147.93,2811.78 2147.85,2811.92 2147.79,2812.07 2147.75,2812.22 2147.71,2812.37 2147.69,2812.53 2147.68,2812.68 2147.68,2868.68 2147.69,2868.84 2147.71,2868.99 2147.75,2869.15 2147.79,2869.3 2147.85,2869.44 2147.93,2869.58 2148.01,2869.71 2148.11,2869.84 2148.21,2869.95 2148.33,2870.06 2148.45,2870.16 2148.58,2870.24 2148.72,2870.31 2148.87,2870.37 2149.02,2870.42 2149.17,2870.45 2149.33,2870.48 2149.48,2870.48 2295.48,2870.48 2295.64,2870.48 2295.8,2870.45 2295.95,2870.42 2296.1,2870.37 2296.24,2870.31 2296.38,2870.24 2296.52,2870.16 2296.64,2870.06 2296.76,2869.95 2296.86,2869.84 2296.96,2869.71 2297.04,2869.58 2297.12,2869.44 2297.18,2869.3 2297.22,2869.15 2297.26,2868.99 2297.28,2868.84 2297.28,2868.68
GND on Bottom Layer: 2264.81,2829.3 2264.81,2833 2259.79,2833 2259.72,2833.18 2260.02,2833.48 2259.98,2833.56 2256.58,2833.56 2256.58,2835.85 2254.75,2837.68 2248.68,2837.68 2244.89,2841.46 2244.89,2844.66 2245.27,2845.04 2262.24,2845.04 2268.82,2851.62 2273.37,2851.62 2273.72,2851.98 2287.44,2851.98 2288.07,2851.34 2288.07,2837.83 2286.78,2836.54 2270.78,2836.54 2268.57,2834.33 2268.57,2829.3
GND on Bottom Layer: 2241.34,2829.26 2241.34,2833 2242.02,2833 2242.49,2833.48 2242.46,2833.56 2241.03,2833.56 2241.03,2836.69 2237.43,2840.29 2231.35,2840.29 2227.44,2844.21 2227.44,2844.64 2227.82,2845.02 2242.05,2845.02 2242.68,2844.38 2242.68,2840.27 2247.94,2835.01 2253.61,2835.01 2254.21,2834.4 2254.21,2833 2253.73,2833 2253.73,2829.27 2249.59,2829.27 2249.59,2832.93 2242.33,2832.93 2242.33,2829.26
GND on Bottom Layer: 2211.39,2831.1 2211.39,2829.27 2210.6,2829.27 2210.6,2831.1
GND on Bottom Layer: 2149.48,2810.88 2149.33,2810.89 2149.17,2810.91 2149.02,2810.94 2148.87,2810.99 2148.72,2811.05 2148.58,2811.12 2148.45,2811.21 2148.33,2811.3 2148.21,2811.41 2148.11,2811.53 2148.01,2811.65 2147.93,2811.78 2147.85,2811.92 2147.79,2812.07 2147.75,2812.22 2147.71,2812.37 2147.69,2812.53 2147.68,2812.68 2147.68,2868.68 2147.69,2868.84 2147.71,2868.99 2147.75,2869.15 2147.79,2869.3 2147.85,2869.44 2147.93,2869.58 2148.01,2869.71 2148.11,2869.84 2148.21,2869.95 2148.33,2870.06 2148.45,2870.16 2148.58,2870.24 2148.72,2870.31 2148.87,2870.37 2149.02,2870.42 2149.17,2870.45 2149.33,2870.48 2149.48,2870.48 2295.48,2870.48 2295.64,2870.48 2295.8,2870.45 2295.95,2870.42 2296.1,2870.37 2296.24,2870.31 2296.38,2870.24 2296.52,2870.16 2296.64,2870.06 2296.76,2869.95 2296.86,2869.84 2296.96,2869.71 2297.04,2869.58 2297.12,2869.44 2297.18,2869.3 2297.22,2869.15 2297.26,2868.99 2297.28,2868.84 2297.28,2868.68 2297.28,2812.68 2297.28,2812.53 2297.26,2812.37 2297.22,2812.22 2297.18,2812.07 2297.12,2811.92 2297.04,2811.78 2296.96,2811.65 2296.86,2811.53 2296.76,2811.41 2296.64,2811.3 2296.52,2811.21 2296.38,2811.12 2296.24,2811.05 2296.1,2810.99 2295.95,2810.94 2295.8,2810.91 2295.64,2810.89 2295.48,2810.88 2280.1,2810.88 2280.1,2833.61 2273.11,2833.61 2273.11,2829.29 2271.74,2829.29 2271.74,2833.08 2271.59,2833.08 2271.59,2833.76 2272.07,2834.25 2287.92,2834.25 2290.21,2836.53 2290.21,2852.61 2288.62,2854.2 2273.93,2854.2 2273.93,2855.51 2292.37,2855.51 2293.61,2854.26 2293.61,2836.2 2290,2832.59 2284.42,2832.59 2283.45,2831.63 2283.45,2830.08 2284.49,2829.04 2289.98,2829.04 2295.95,2835.01 2295.95,2855.79 2293.68,2858.05 2273.93,2858.05 2273.93,2864.8 2273.24,2865.49 2224.9,2865.49 2224.65,2865.23 2224.65,2862.74 2225.59,2861.8 2225.59,2858.02 2222.26,2858.02 2221.78,2857.54 2221.78,2853.02 2225.89,2848.9 2225.89,2848.55 2223.94,2846.59 2223.94,2844.25 2230.21,2837.98 2235.9,2837.98 2238.67,2835.21 2238.67,2833.56 2238.29,2833.56 2238.29,2833 2238.24,2833 2238.24,2829.26 2234.33,2829.26 2234.33,2833 2226.96,2833 2226.96,2829.26 2225.84,2829.26 2225.84,2833.05 2226.26,2833.47 2226.23,2833.56 2225.77,2833.56 2225.77,2833.99 2225.72,2833.99 2225.72,2841.1 2220.48,2846.34 2220.48,2850.37 2220.15,2850.71 2218.63,2850.71 2217.84,2849.92 2217.84,2844.81 2223.02,2839.63 2223.02,2833 2222.74,2833 2222.74,2829.26 2218.76,2829.26 2218.76,2832.94 2213.32,2832.94 2213.32,2833.51 2213.3,2833.56 2208.77,2833.56 2208.77,2833.99 2208.11,2833.99 2208.11,2842.12 2212.97,2846.97 2212.97,2850.15 2212.33,2850.78 2210.96,2850.78 2210.17,2849.99 2210.17,2847.5 2206.01,2843.34 2206.01,2829.32 2202.88,2829.32 2202.88,2833.2 2195.47,2833.2 2195.47,2829.34 2193.29,2829.34 2193.3,2829.65 2193.38,2829.8 2193.45,2829.97 2193.5,2830.13 2193.54,2830.3 2193.57,2830.47 2193.58,2830.65 2193.57,2830.82 2193.55,2831 2193.51,2831.17 2193.46,2831.33 2193.4,2831.5 2193.32,2831.65 2193.22,2831.8 2193.12,2831.94 2192.95,2832.12 2200.14,2839.3 2200.14,2841.59 2205.04,2846.49 2205.04,2849.99 2204.35,2850.68 2203.24,2850.68 2202.47,2849.92 2202.47,2847.53 2197.83,2842.88 2197.83,2840.32 2191.5,2833.99 2190.28,2833.99 2190.28,2832.19 2190.15,2832.07 2190.04,2831.94 2189.93,2831.8 2189.84,2831.66 2189.76,2831.5 2189.69,2831.34 2189.64,2831.17 2189.6,2831 2189.58,2830.83 2189.58,2830.65 2189.58,2830.48 2189.61,2830.31 2189.65,2830.14 2189.7,2829.97 2189.77,2829.81 2189.85,2829.66 2186.11,2829.42 2186.11,2832.09 2185.2,2833 2179.36,2833 2178.42,2832.06 2178.42,2829.57 2178.4,2829.55 2177.38,2829.55 2177.38,2831.71 2176.59,2832.49 2176.31,2832.49 2176.31,2840.19 2177.89,2841.76 2191.6,2841.76 2197.19,2847.35 2197.19,2850.1 2196.53,2850.76 2195.34,2850.76 2194.55,2849.97 2194.55,2848.24 2190.28,2843.97 2176.77,2843.97 2174.15,2841.36 2174.15,2832.49 2173.77,2832.49 2173.19,2831.91 2173.19,2829.57 2172.93,2829.32 2170.22,2829.32 2169.89,2829.65 2169.89,2841.23 2164.5,2846.62 2164.5,2846.74 2150.76,2846.74 2150.28,2846.26 2150.28,2830.74 2151.14,2829.88 2154.52,2829.88 2154.52,2810.88
V+ on Top Layer: 2279.34,2814.21 2276.72,2811.59 2159.83,2811.59 2155.54,2815.89 2155.54,2829.4 2154.37,2830.57 2151.73,2830.57 2151.07,2831.23 2151.07,2846.14 2163.66,2846.14 2169.1,2840.7 2169.1,2828.48 2179.18,2828.48 2179.18,2831.79 2179.79,2832.4 2185,2832.4 2185.3,2832.09 2185.3,2828.48 2196.23,2828.48 2196.23,2831.89 2196.84,2832.5 2202.04,2832.5 2202.35,2832.19 2202.35,2828.48 2211.97,2828.48 2211.97,2831.81 2212.58,2832.42 2217.79,2832.42 2218.1,2832.12 2218.1,2828.48 2227.52,2828.48 2227.52,2831.84 2228.13,2832.45 2233.34,2832.45 2233.64,2832.14 2233.64,2828.48 2242.78,2828.48 2242.78,2831.86 2243.39,2832.47 2248.6,2832.47 2248.91,2832.17 2248.91,2828.48 2257.95,2828.48 2257.95,2831.81 2258.56,2832.42 2263.77,2832.42 2264.07,2832.12 2264.07,2828.48 2272.91,2828.48 2274.03,2829.6 2274.03,2832.06 2275.02,2833.06 2278.5,2833.06 2279.34,2832.22
V+ on Top Layer: 2257.95,2831.81 2257.95,2835.82 2255.71,2838.06 2255.71,2841.13 2260.54,2841.13 2260.54,2831.56 2260.59,2831.51 2260.59,2831.13 2258.63,2831.13
V+ on Bottom Layer: 2279.34,2814.18 2276.77,2811.62 2159.8,2811.62 2155.71,2815.71 2155.71,2829.22 2154.37,2830.57 2151.73,2830.57 2151.07,2831.23 2151.07,2846.14 2163.69,2846.14 2169.1,2840.73 2169.1,2828.48 2179.18,2828.48 2179.18,2831.79 2179.79,2832.4 2184.69,2832.4 2184.97,2832.12 2184.97,2828.48 2196.23,2828.48 2196.23,2831.89 2196.84,2832.5 2202.04,2832.5 2202.35,2832.19 2202.35,2828.48 2211.97,2828.48 2211.97,2831.81 2212.58,2832.42 2217.79,2832.42 2218.1,2832.12 2218.1,2828.48 2227.52,2828.48 2227.52,2831.84 2228.13,2832.45 2233.34,2832.45 2233.64,2832.14 2233.64,2828.48 2242.78,2828.48 2242.78,2831.86 2243.39,2832.47 2248.6,2832.47 2248.91,2832.17 2248.91,2828.48 2257.95,2828.48 2257.95,2831.81 2258.56,2832.42 2263.77,2832.42 2264.07,2832.12 2264.07,2828.48 2272.91,2828.48 2274.03,2829.6 2274.03,2832.06 2275.02,2833.06 2278.5,2833.06 2279.34,2832.22
N41242 on Top Layer: 2174.38,2844.38 2168.92,2844.38 2165.29,2848.02 2165.27,2848.01 2164.12,2849.16 2150.53,2849.16 2150.53,2856.37 2160.18,2866.02 2179.92,2866.02 2181.42,2864.53 2181.42,2857.62 2179.36,2855.56 2179.34,2855.56 2176.06,2852.28 2176.06,2846.06
N62837 on Top Layer: 2269.58,2841.87 2271.41,2841.87 2273.01,2843.47 2273.01,2846.8 2272.83,2846.97 2271.46,2846.97 2271.18,2846.7 2271.18,2843.47 2270.22,2842.5 2269.4,2842.5 2269.4,2842.05

## Text on the board
Top Silkscreen Layer: Chaarger | IN BAT | 8 | POWER | 2 | 4 | 7 | 3 | GND | 1 | 5 | 6 | QV-601-Control | FAN2 | FAN1 | FAN4 | FAN3 | EXT BAT | V- | V+
PIN_NUMBER: FIGURE | ALL UNITS ARE IN MILLIMETERS | DRILL CHART: TOP to BOTTOM | 1.9x1.4 | 2.6x0.9 | 0.254 | 0.508 | SIZE | 0.97 | 0.8 | 0.9 | 1.7 | 1.8 | 6.0 | PLATED | QTY | 661 | 36 | 16 | 24 | 7 | 4 | 8 | 2 | 1
